# EAGLE design flamingo_pcb (EAGLE 9.6.2)
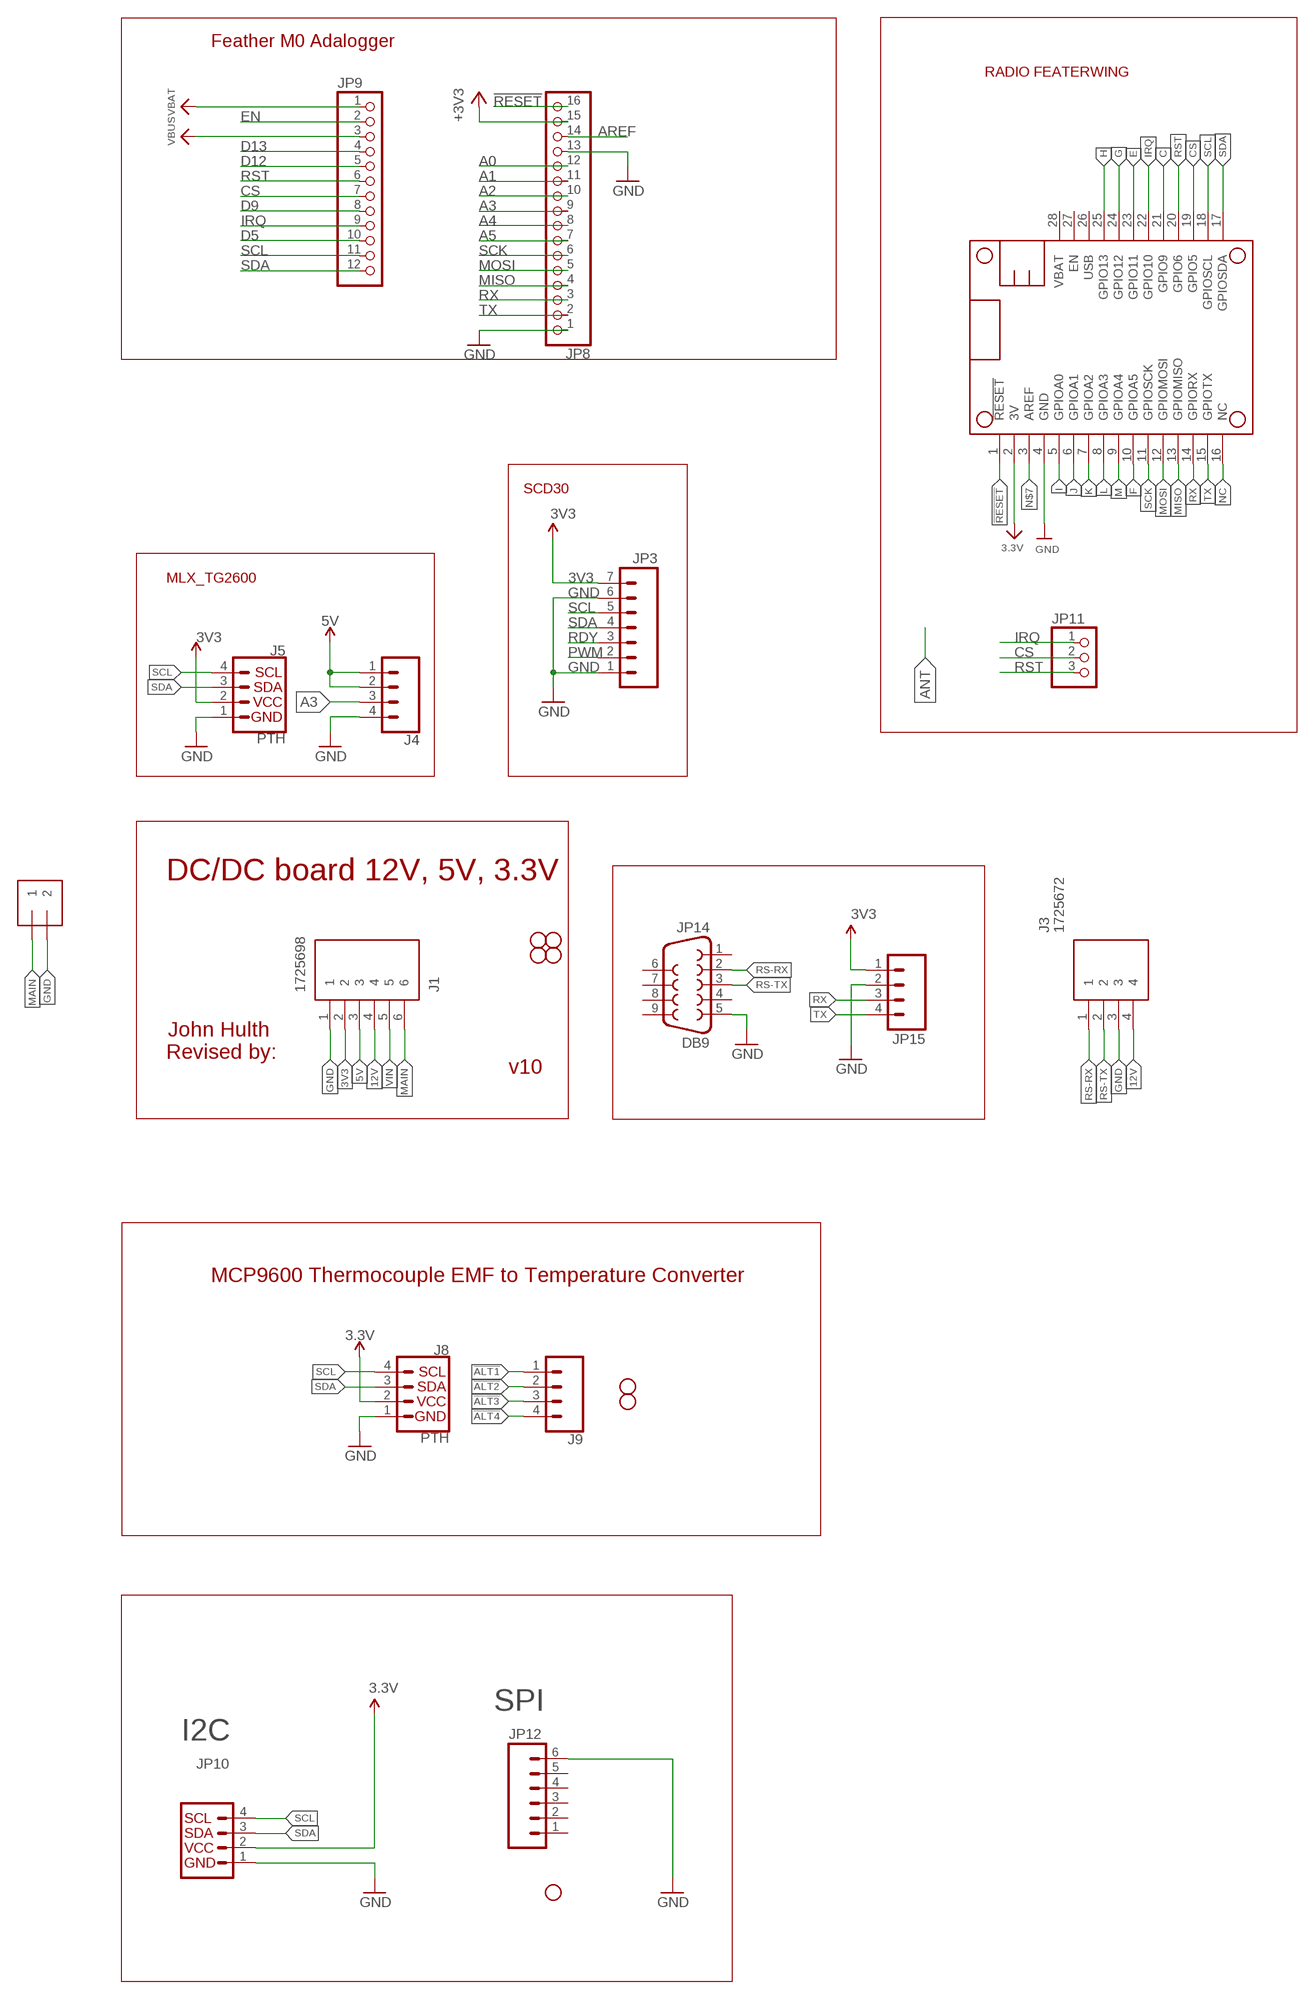
[diagram p0: schematic, sheet 1]

## Parts
J1  1725698  [SHDR6W90P0X254_1X6_1570X620X85]
J2  ADAFRUIT_1X2-3.5MM  [ADAFRUIT_1X2-3.5MM]
J3  1725672  [1725672-4-2.54]
J4  CONN_041X04_NO_SILK  [1X04_NO_SILK]
J5  PTH  I2C_STANDARD_NO_SILK  [1X04_NO_SILK]
J8  PTH  I2C_STANDARD_NO_SILK  [1X04_NO_SILK]
J9  CONN_041X04_NO_SILK  [1X04_NO_SILK]
JP1  STAND-OFF  [STAND-OFF]
JP3  M07  [1X07]
JP4  STAND-OFF  [STAND-OFF]
JP5  STAND-OFF  [STAND-OFF]
JP6  STAND-OFF  [STAND-OFF]
JP8  HEADER-1X16ROUND  [1X16_ROUND]
JP9  HEADER-1X12  [1X12_ROUND]
JP10  I2C_STANDARD_NO_SILK  [1X04_NO_SILK]
JP11  HEADER-1X376MIL  [1X03_ROUND_76]
JP12  M06NO_SILK_FEMALE_PTH  [1X06_NO_SILK]
JP13  STAND-OFF  [STAND-OFF]
JP14  DB9  DB9FEMALE  [DB9]
JP15  M04PTH  [1X04@1]
JP16  STAND-OFF  [STAND-OFF]
MS2  FEATHERWING_NOHOLES  [FEATHERWING_NOHOLES]
STANDOFF1  STAND-OFF  [STAND-OFF]

## Nets
3V3: J1.2 J5.2 J8.2 JP3.7 JP8.15 JP10.2 JP15.1 MS2.2(3V) ; supply symbol labelled 3.3V, VCC, +3V3
5V: J1.3 J4.1 J4.2
12V: J1.4 J3.4
!ALT1: J9.1
!ALT2: J9.2
!ALT3: J9.3
!ALT4: J9.4
!RESET: JP8.16 MS2.1(!RESET)
A0: JP8.12
A1: JP8.11
A2: JP8.10
A3: J4.3 JP8.9
A4: JP8.8
A5: JP8.7
AREF: JP8.14
C: MS2.21(GPIO9)
CS: JP9.7 JP11.2 MS2.19(GPIO5)
D5: JP9.10
D9: JP9.8
D12: JP9.5
D13: JP9.4
E: MS2.23(GPIO11)
EN: JP9.2
F: MS2.10(GPIOA5)
G: MS2.24(GPIO12)
GND: J1.1 J2.2 J3.3 J4.4 J5.1 J8.1 JP3.1 JP3.6 JP8.1 JP8.13 JP10.1 JP12.6 JP14.5 JP15.2 MS2.4(GND)
H: MS2.25(GPIO13)
I: MS2.5(GPIOA0)
IRQ: JP9.9 JP11.1 MS2.22(GPIO10)
J: MS2.6(GPIOA1)
K: MS2.7(GPIOA2)
L: MS2.8(GPIOA3)
M: MS2.9(GPIOA4)
MAIN: J1.6 J2.1
MISO: JP8.4 MS2.13(GPIOMISO)
MOSI: JP8.5 MS2.12(GPIOMOSI)
N$7: MS2.3(AREF)
NC: MS2.16(NC)
PWM: JP3.2
RDY: JP3.3
RS-RX: J3.1 JP14.2
RS-TX: J3.2 JP14.3
RST: JP9.6 JP11.3 MS2.20(GPIO6)
RX: JP8.3 JP15.3 MS2.14(GPIORX)
SCK: JP8.6 MS2.11(GPIOSCK)
SCL: J5.4 J8.4 JP3.5 JP9.11 JP10.4 MS2.18(GPIOSCL)
SDA: J5.3 J8.3 JP3.4 JP9.12 JP10.3 MS2.17(GPIOSDA)
TX: JP8.2 JP15.4 MS2.15(GPIOTX)
VBAT: JP9.1
VBUS: JP9.3
VIN: J1.5
Unconnected: JP12.1 JP12.2 JP12.3 JP12.4 JP12.5 JP14.1 JP14.4 JP14.6 JP14.7 JP14.8 JP14.9 MS2.26(USB) MS2.27(EN) MS2.28(VBAT)

## Notes on the sheet
- Feather M0 Adalogger
- RADIO FEATERWING
- SCD30
- MLX_TG2600
- DC/DC board 12V, 5V, 3.3V
- John Hulth
- Revised by:
- v10
- MCP9600 Thermocouple EMF to Temperature Converter
- SPI
- I2C

## Library data of the parts
J1 = 154N_NAU7802_TH:1725698: 6 way PCB vertical mount terminal,2.54mm 6 way PCB vertical mount terminal,2.54mm Source: Datasheet; ALLIED_NUMBER: 70054339; DESCRIPTION: 6 way PCB vertical mount terminal,2.54mm 6 way PCB vertical mount terminal,2.54mm; HEIGHT: 8.5mm; MANUFACTURER_NAME: Phoenix Contact; MANUFACTURER_PART_NUMBER: 1725698; RS_PART_NUMBER: 3909045; RS_PRICE-STOCK: https://uk.rs-online.com/web/p/products/3909045
J2 = DCDC-Relay:ADAFRUIT_1X2: 3.5mm Terminal block http://www.ladyada.net/library/pcb/eaglelibrary.html
J3 = 1725672:1725672: 4 way vertical PCB terminal,6A 63V Phoenix Contact Non-Fused Terminal Block, 4 Way, Solder Terminals, 26 ??? 20 AWG Through Hole, Nylon, 63 V Source: Datasheet <https://www.phoenixcontact.com/online/portal/us?uri=pxc-oc-itemdetail:pid=1725672&library=usen&tab=1.pdf>; ALLIED_NUMBER: 70054337; DESCRIPTION: 4 way vertical PCB terminal,6A 63V Phoenix Contact Non-Fused Terminal Block, 4 Way, Solder Terminals, 26 ??? 20 AWG Through Hole, Nylon, 63 V; HEIGHT: mm; MANUFACTURER_NAME: Phoenix Contact; MANUFACTURER_PART_NUMBER: 1725672; RS_PART_NUMBER: 3924476; RS_PRICE-STOCK: https://uk.rs-online.com/web/p/products/3924476
J4 J9 = SparkFun-Connectors:CONN_04: Multi connection point. Often used as Generic Header-pin footprint for 0.1 inch spaced/style header connections On any of the 0.1 inch spaced packages, you can populate with these: Break Away Headers - Straight <https://www.sparkfun.com/products/116> (PRT-00116) Break Away Male Headers - Right Angle <https://www.sparkfun.com/products/553> (PRT-00553) Female Headers <https://www.sparkfun.com/products/115> (PRT-00115) Break Away Headers - Machine Pin <https://www.sparkfun.com/products/117> (PRT-00117) Break Away Female Headers - Swiss Machine Pin <https://www.sparkfun.com/products/743> (PRT-00743) For SCREWTERMINALS and SPRING TERMINALS visit here: Screw Terimnals on SparkFun.com <https://www.sparkfun.com/search/results?term=Screw+Terminals> (5mm/3.5mm/2.54mm spacing) This device is also useful as a general connection point to wire up your design to another part of your project. Our various solder wires solder well into these plated through hole pads. Hook-Up Wire - Assortment (Stranded, 22 AWG) <https://www.sparkfun.com/products/11375> (PRT-11375) Hook-Up Wire - Assortment (Solid Core, 22 AWG) <https://www.sparkfun.com/products/11367> (PRT-11367) View the entire wire category on our website here <https://www.sparkfun.com/categories/141> Special notes: Molex polarized connector foot print use with SKU : PRT-08231 with associated crimp pins and housings. 1MM SMD Version SKU: PRT-10208; PROD_ID: CONN-09696
J5 J8 JP10 = SparkFun-Connectors:I2C_STANDARD: SparkFun I2C Standard Pinout Header SparkFun has standardized on a pinout for all I2C based sensor breakouts. This pinout allows I2C boards to be plugged directly into the headers on Arduino Uno compatible boards, and to be daisy chained easily. Example SparkFun Products: SparkFun Atmospheric Sensor Breakout - BME280 <https://www.sparkfun.com/products/13676> SparkFun Altitude/Pressure Sensor Breakout - MPL3115A2 <https://www.sparkfun.com/products/11084> SparkFun TOF Range Finder Sensor - VL6180 <https://www.sparkfun.com/products/12785>
JP1 JP4-JP6 JP13 JP16 = SparkFun:STAND-OFF: Stand Off This is the mechanical footprint for a #4 phillips button head screw. Use the keepout ring to avoid running the screw head into surrounding components. SKU : PRT-00447
JP3 = SparkFun-Connectors:M07: Header 7 Standard 7-pin 0.1" header. Use with straight break away headers (SKU : PRT-00116), right angle break away headers (PRT-00553), swiss pins (PRT-00743), machine pins (PRT-00117), and female headers (PRT-00115). NOTES ON THE VARIANTS LOCK and LOCK_LONGPADS... This footprint was designed to help hold the alignment of a through-hole component (i.e. 7-pin header) while soldering it into place. You may notice that each hole has been shifted either up or down by 0.005 of an inch from it's more standard position (which is usually a perfectly straight line). This slight alteration caused the pins (the squares in the middle) to touch the edges of the holes. Because they are alternating, it causes a "brace" to hold the header in place. 0.005 has proven to be the perfect amount of "off-center" position when using our standard breakaway headers. Although looks a little odd when you look at the bare footprint, once you have a header in there, the alteration is very hard to notice. Also, if you push a header all the way into place, it is covered up entirely on the bottom side. This idea of altering the position of holes to aid alignment will be further integrated into the Sparkfun Library for other footprints. It can help hold any component with 3 or more connection pins.
JP8 = microbuilder:HEADER-1X16: PIN HEADER
JP9 = microbuilder:HEADER-1X12
JP11 = microbuilder:HEADER-1X3: PIN HEADER
JP12 = SparkFun-Connectors:M06: Header 6 Standard 6-pin 0.1" header. Use with straight break away headers (SKU : PRT-00116), right angle break away headers (PRT-00553), swiss pins (PRT-00743), machine pins (PRT-00117), and female headers (PRT-00115). Molex polarized connector foot print use with SKU : PRT-08094 with associated crimp pins and housings. NOTES ON THE VARIANTS LOCK and LOCK_LONGPADS... This footprint was designed to help hold the alignment of a through-hole component (i.e. 6-pin header) while soldering it into place. You may notice that each hole has been shifted either up or down by 0.005 of an inch from it's more standard position (which is a perfectly straight line). This slight alteration caused the pins (the squares in the middle) to touch the edges of the holes. Because they are alternating, it causes a "brace" to hold the component in place. 0.005 has proven to be the perfect amount of "off-center" position when using our standard breakaway headers. Although looks a little odd when you look at the bare footprint, once you have a header in there, the alteration is very hard to notice. Also,if you push a header all the way into place, it is covered up entirely on the bottom side. This idea of altering the position of holes to aid alignment will be further integrated into the Sparkfun Library for other footprints. It can help hold any component with 3 or more connection pins.; PROD_ID: CONN-08437
JP14 = SparkFun-Connectors:DB9: DB9 Connector Standard DB9 (D-Sub 9) serial connector. Can be used for CAN bus as well as RS485 and RS232. Footprint production proven. Spark Fun Electronics SKU : PRT-00429; PROD_ID: CONN-08194
JP15 = SparkFun-Connectors:M04: Header 4 Standard 4-pin 0.1" header. Use with straight break away headers (SKU : PRT-00116), right angle break away headers (PRT-00553), swiss pins (PRT-00743), machine pins (PRT-00117), and female headers (PRT-00115). Molex polarized connector foot print use with SKU : PRT-08231 with associated crimp pins and housings. 1MM SMD Version SKU: PRT-10208
MS2 = microbuilder:FEATHERWING
STANDOFF1 = SparkFun-Electromechanical:STAND-OFF: #4 Stand Off This is the mechanical footprint for a #4 phillips button head screw. Use the keepout ring to avoid running the screw head into surrounding components. SKU : PRT-00447

## Board
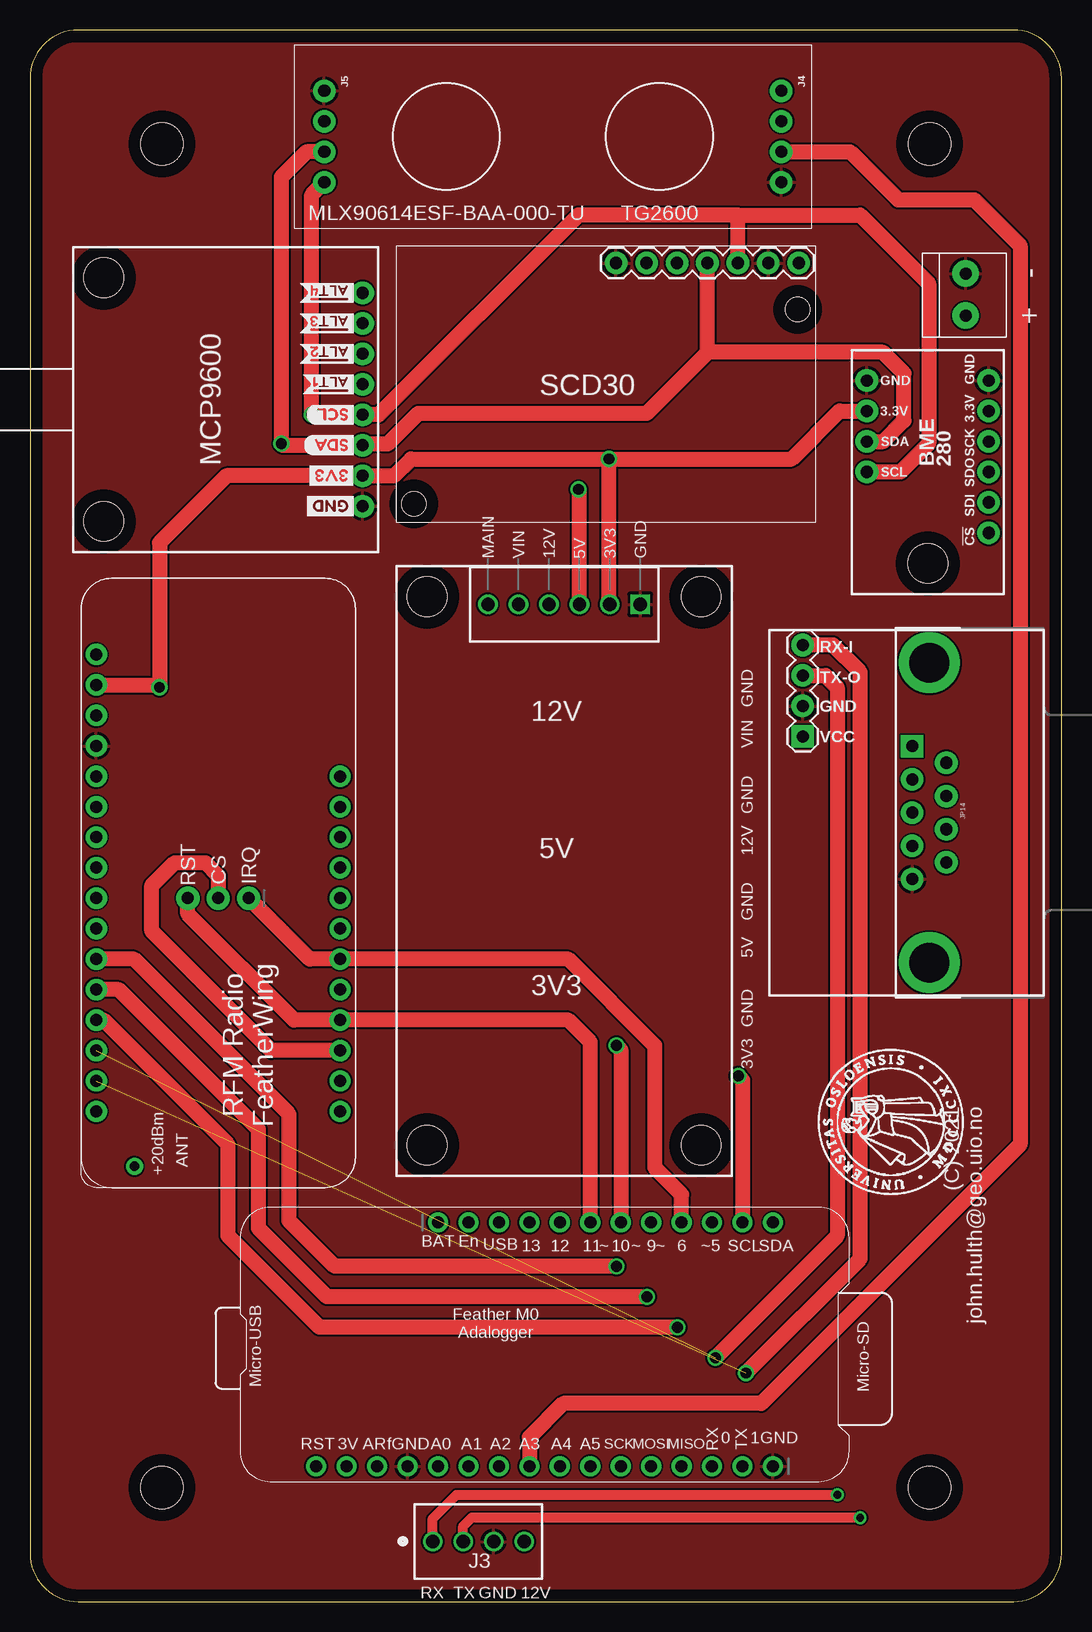
[diagram p1: board, top side]
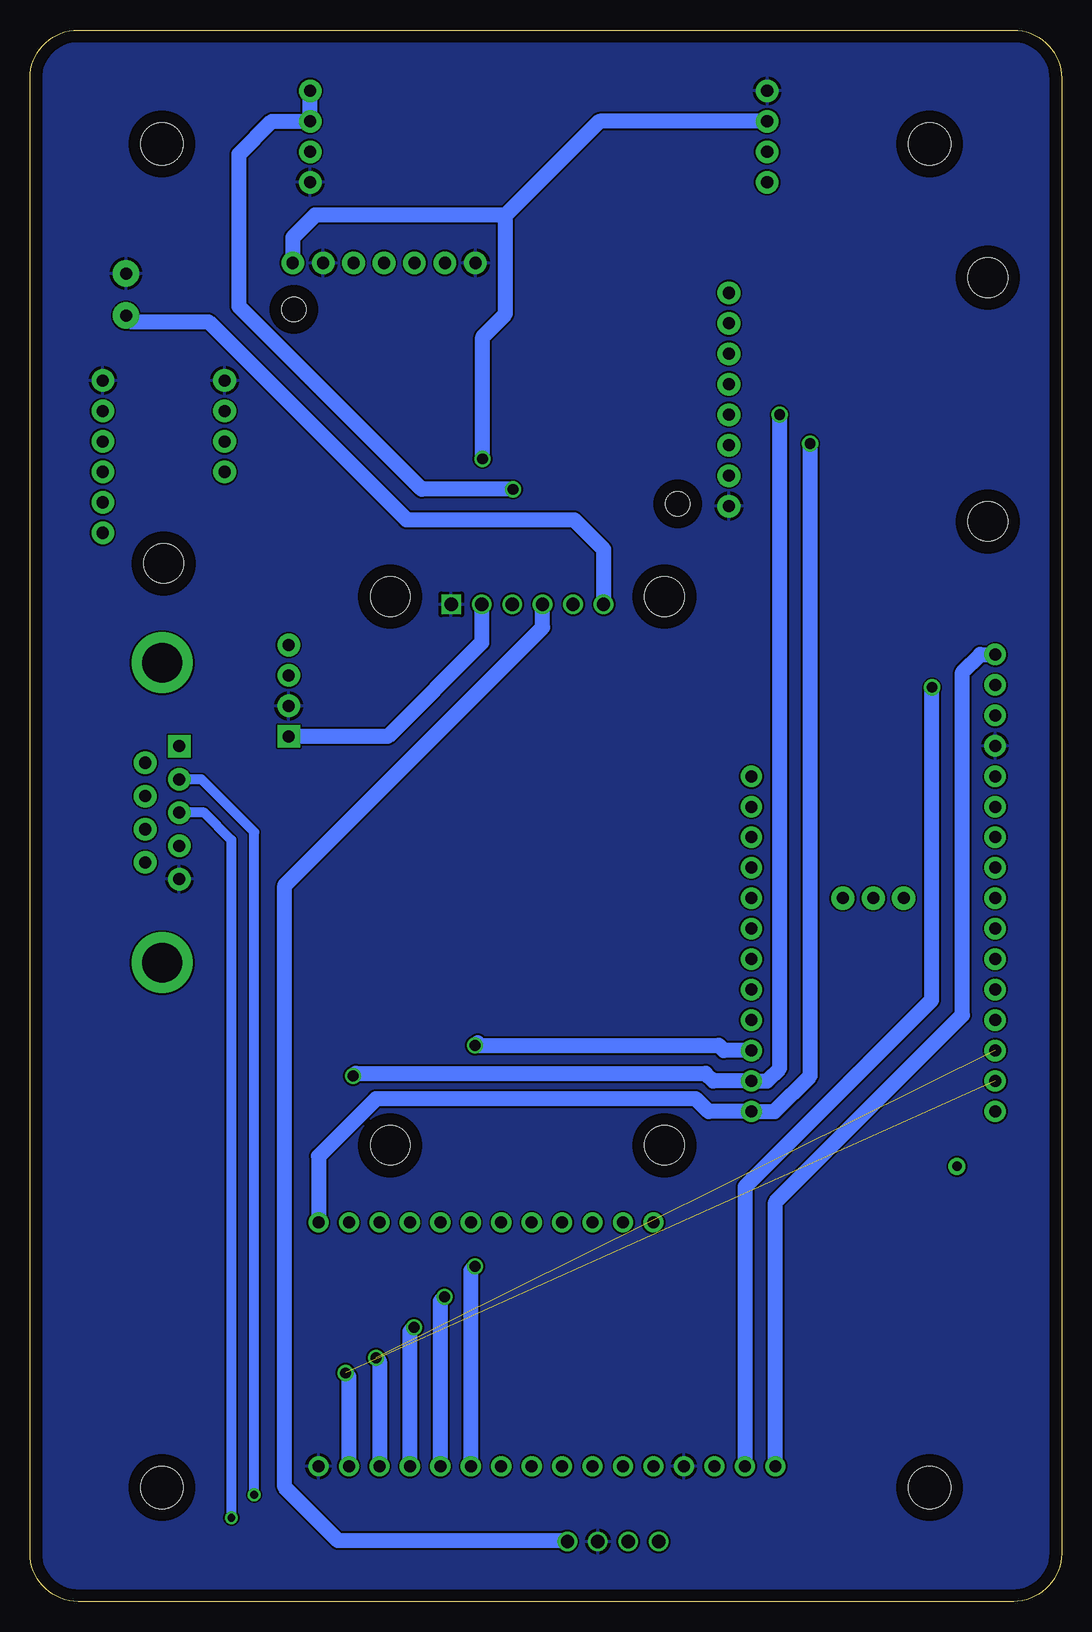
[diagram p2: board, bottom side, seen from below]

Size 86 x 131 mm. Coordinates in mm from the lower left corner, seen from the top.
Outline: 86,4 86,127 arc90 82,131 4,131 arc90 0,127 0,4 arc90 4,0 82,0 arc90 86,4
Copper layers (1*16): Top 0.035mm / dielectric 1.5mm / Bottom 0.035mm
Design rules "default": minimum track width 6mil, minimum drill 0.35mm, track to track 6mil, track to pad 6mil, pad to pad 6mil, via to via 6mil, smd to smd 6mil, copper to edge 40mil, drill to drill 6mil, minimum pad ring 10mil, minimum via ring 8mil, stop-mask expansion 4mil, vias tented up to drill 0mil, thermal gap 10mil
Holes 3.5 mm at 11,121.5 75,121.5 75,9.5 11,9.5
Holes 2 mm at 64,107.7 32,91.5

### Footprints (pad centres in the part's own frame; a part is rotated, then mirrored left to right if it is on the bottom)
SHDR6W90P0X254_1X6_1570X620X85 = drill 1.1 pad 1.65 square: 1 0,0 | drill 1.1 pad 1.65: 2 2.54,0; 3 5.08,0; 4 7.62,0; 5 10.16,0; 6 12.7,0
ADAFRUIT_1X2-3.5MM = drill 1 pad 2.184: 1 1.8,0; 2 -1.7,0
1725672-4-2.54 = drill 1.1 pad 1.65: 1 0,0; 2 2.54,0; 3 5.08,0; 4 7.62,0
1X04_NO_SILK = drill 1.016 pad 1.88: 1 0,0; 2 2.54,0; 3 5.08,0; 4 7.62,0
STAND-OFF = hole 3.302: 0,0
1X07 = drill 1.016 pad 1.88: 1 0,0; 2 2.54,0; 3 5.08,0; 4 7.62,0; 5 10.16,0; 6 12.7,0; 7 15.24,0
1X16_ROUND = drill 1 pad 1.676: 1 -19.05,0; 2 -16.51,0; 3 -13.97,0; 4 -11.43,0; 5 -8.89,0; 6 -6.35,0; 7 -3.81,0; 8 -1.27,0; 9 1.27,0; 10 3.81,0; 11 6.35,0; 12 8.89,0; 13 11.43,0; 14 13.97,0; 15 16.51,0; 16 19.05,0
1X12_ROUND = drill 1 pad 1.676: 1 -13.97,0; 2 -11.43,0; 3 -8.89,0; 4 -6.35,0; 5 -3.81,0; 6 -1.27,0; 7 1.27,0; 8 3.81,0; 9 6.35,0; 10 8.89,0; 11 11.43,0; 12 13.97,0
1X03_ROUND_76 = drill 1 pad 1.93: 1 -2.54,0; 2 0,0; 3 2.54,0
1X06_NO_SILK = drill 1.016 pad 1.88: 1 0,0; 2 2.54,0; 3 5.08,0; 4 7.62,0; 5 10.16,0; 6 12.7,0
DB9 = drill 1.016 pad 1.88 square: 1 -5.54,-1.42 | drill 1.016 pad 1.88: 2 -2.77,-1.42; 3 0,-1.42; 4 2.77,-1.42; 5 5.54,-1.42; 6 -4.15,1.42; 7 -1.38,1.42; 8 1.38,1.42; 9 4.15,1.42 | drill 3.302 pad 5.08: G1 -12.5,0; G2 12.5,0
1X04@1 = drill 1.016 pad 1.88 square: 1 0,0 | drill 1.016 pad 1.88: 2 2.54,0; 3 5.08,0; 4 7.62,0
FEATHERWING_NOHOLES = drill 1 pad 1.778: 1 6.35,1.27; 2 8.89,1.27; 3 11.43,1.27; 4 13.97,1.27; 5 16.51,1.27; 6 19.05,1.27; 7 21.59,1.27; 8 24.13,1.27; 9 26.67,1.27; 10 29.21,1.27; 11 31.75,1.27; 12 34.29,1.27; 13 36.83,1.27; 14 39.37,1.27; 15 41.91,1.27; 16 44.45,1.27; 17 44.45,21.59; 18 41.91,21.59; 19 39.37,21.59; 20 36.83,21.59; 21 34.29,21.59; 22 31.75,21.59; 23 29.21,21.59; 24 26.67,21.59; 25 24.13,21.59; 26 21.59,21.59; 27 19.05,21.59; 28 16.51,21.59

### Placement (x,y rotation side)
J1  50.88,83.12 180 top
J2  78,109 270 top
J3  33.58,5 0 top
J4  62.64,125.93 270 top
J5  24.54,125.93 270 top
J8  27.73,91.31 90 top
J9  27.73,101.47 90 top
JP1  33.1,83.76 90 top
JP3  48.86,111.58 0 top
JP4  33.1,38.04 90 top
JP5  55.96,38.04 90 top
JP6  55.96,83.76 90 top
JP8  42.9,11.27 180 top
JP9  47.98,31.59 0 top
JP10  69.77,101.78 270 top
JP11  15.7,58.63 180 top
JP12  79.93,89.08 90 top
JP13  6.14,110.36 90 top
JP14  74.97,65.76 270 top
JP15  64.43,72.11 90 top
JP16  6.14,90.04 90 top
MS2  4.27,85.3 270 top
STANDOFF1  74.85,86.54 0 top
U$3  [UIO-LOGO-BL]  78.11,33.66 90 top
U$13  [GND0]  27.48,91.31 180 top
U$14  [3V31]  27.48,93.85 180 top
U$15  [SDA2]  27.48,96.39 180 top
U$16  [SCL3]  27.48,98.93 180 top
U$17  [#ALT14]  27.6,101.47 180 top
U$18  [#ALT25]  27.6,104.01 180 top
U$19  [#ALT36]  27.6,106.55 180 top
U$20  [#ALT47]  27.6,109.09 180 top

### Tracks (layer width: path | path; a pad name or v marks a point on that pad's centre or on a via)
3V3  (via drill 0.9)
  Top 1.27: J1.2 48.26,83.2 v48.26,95.25 | v48.26,95.25 63.5,95.25 67.49,99.24 JP10.2 | v48.26,95.25 31.75,95.25 30.35,93.85 J8.2 16.38,93.85 10.79,88.27 v10.79,76.2 10.59,76.41 MS2.2
  Bottom 1.27: v48.26,95.25 48.26,105.41 46.35,107.31 46.35,115.57 | 46.35,115.57 62.23,115.57 64.1,113.7 JP3.7 | J5.2 38.53,123.39 46.35,115.57 | J1.2 48.34,79.93 56.16,72.11 JP15.1 | v10.79,76.2 10.85,76.15 10.85,50.11 26.39,34.57 JP8.15
5V  (via drill 0.9)
  Top 1.27: J1.3 45.8,92.63 v45.72,92.71
  Bottom 1.27: J4.1 J4.2 65.84,123.39 68.58,120.65 68.58,107.95 53.34,92.71 v45.72,92.71
12V
  Bottom 1.27: J3.4 41.28,5.08 60.33,5.08 64.77,9.53 64.77,59.69 43.26,81.2 J1.4
!RESET
  Bottom 1.27: JP8.16 23.85,33.3 8.26,48.9 8.26,77.47 6.78,78.95 MS2.1
A3
  Top 1.27: J4.3 68.38,120.85 72.39,116.84 78.74,116.84 82.55,113.03 82.55,38.1 60.96,16.51 44.45,16.51 41.63,13.69 JP8.9
ANT  (via drill 0.8 pad 1.42)
  other vias: 8.71,36.28
CS  (via drill 0.9)
  Top 1.27: JP9.7 49.25,46 v48.9,46.35 | MS2.19 20.11,45.93 10.16,55.88 10.16,59.69 12.06,61.59 14.61,61.59 15.7,60.5 JP11.2
  Bottom 1.27: 48.69,46.56 v48.9,46.35 28.57,46.35 28.15,45.93 MS2.19
GND
  pour Top: -8.89,139.7 -8.89,-1.27 95.25,-1.27 95.25,139.7
  pour Bottom: -8.89,140.97 -8.89,-1.27 95.25,-1.27 95.25,140.97
IRQ
  Top 1.27: JP9.9 54.33,33.94 52.07,36.2 52.07,46.35 44.88,53.55 MS2.22 23.32,53.55 JP11.1
MAIN
  Bottom 1.27: J2.1 77.48,106.68 71.12,106.68 54.61,90.17 40.64,90.17 38.18,87.71 J1.6
MISO  (via drill 0.9)
  Top 1.27: v53.98,22.86 24.13,22.86 16.51,30.48 16.51,38.1 6.14,48.47 MS2.13
  Bottom 1.27: JP8.4 54.33,22.5 v53.98,22.86
MOSI  (via drill 0.9)
  Top 1.27: v51.44,25.4 24.77,25.4 19.05,31.11 19.05,39.37 7.41,51.01 MS2.12
  Bottom 1.27: JP8.5 51.79,25.05 v51.44,25.4
RS-RX  (via drill 0.65)
  Top 0.813: J3.1 33.58,6.91 35.56,8.89 v67.31,8.89
  Bottom 0.813: v67.31,8.89 67.31,64.14 71.7,68.53 JP14.2
RS-TX  (via drill 0.65)
  Top 0.813: J3.2 36.12,6.28 36.83,6.99 v69.22,6.99
  Bottom 0.813: v69.22,6.99 69.22,63.5 71.47,65.76 JP14.3
RST
  Top 1.27: JP9.6 46.71,46.63 44.88,48.47 MS2.20 22.02,48.47 13.16,57.33 JP11.3
RX  (via drill 0.9)  (1 unrouted)
  Top 1.27: JP15.3 66.32,77.19 67.31,76.2 67.31,30.48 v57.15,20.32
  Bottom 1.27: v57.15,20.32 56.87,20.04 JP8.3
SCK  (via drill 0.9)
  Top 1.27: v48.9,27.94 25.4,27.94 21.59,31.75 21.59,40.64 8.68,53.55 MS2.11
  Bottom 1.27: JP8.6 49.25,27.59 v48.9,27.94
SCL  (via drill 0.9)
  Top 1.27: JP3.5 59.02,115.57 | 59.02,115.57 45.72,115.57 29.08,98.93 J8.4 v23.5,98.93 23.5,117.27 J5.4 | 59.02,115.57 69.22,115.57 74.93,109.86 74.93,96.52 72.57,94.16 JP10.4 | v59.05,43.81 59.41,43.46 JP9.11
  Bottom 1.27: v23.5,98.93 23.5,44.45 24.55,43.39 MS2.18 29.04,43.39 29.67,44.02 58.84,44.02 v59.05,43.81
SDA  (via drill 0.9)
  Top 1.27: 56.48,104.14 56.48,104.11 51.44,99.06 32.38,99.06 29.84,96.52 27.86,96.52 J8.3 21.09,96.39 v20.95,96.52 20.95,118.75 23.06,120.85 J5.3 | 56.48,104.14 JP3.4 | JP10.3 71.15,96.7 72.87,98.42 72.87,102.39 71.12,104.14 56.48,104.14
  Bottom 1.27: v20.95,96.52 20.95,43.81 23.92,40.85 MS2.17 29.42,40.85 30.48,41.91 57.15,41.91 61.95,37.11 JP9.12
TX  (via drill 0.9)  (1 unrouted)
  Top 1.27: v59.69,19.05 69.22,28.57 69.22,77.47 66.95,79.73 JP15.4
  Bottom 1.27: JP8.2 59.41,18.77 v59.69,19.05

### Text on the board
tPlace: MLX90614ESF-BAA-000-TU | TG2600 | - | + | GND | SCD30 | GND | MCP9600 | 3.3V | 3.3V | SCK | SDA | BME / 280 | SCL | SDO | SDI | !CS | MAIN | VIN | 12V | 5V | 3V3 | GND | RX-I | TX-O | GND | 12V | GND | VIN | VCC | GND | 5V | 12V | RST | CS | IRQ | GND | 5V | 3V3 | GND | RFM Radio / FeatherWing | 3V3 | (C) 2021 / john.hulth@geo.uio.no | ANT | +20dBm | BAT | En | USB | 13 | 12 | 11 | ~ | 10 | ~ | 9 | ~ | 6 | ~5 | SCL | SDA | Feather M0 / Adalogger | Micro-USB | Micro-SD | RX | 0 | TX | 1 | GND | RST | 3V | ARf | GND | A0 | A1 | A2 | A3 | A4 | A5 | SCK | MOSI | MISO | RX | TX | GND | 12V